# Altium schematic sheet 01-PCIe.SchDoc
size A3; Customer: 01910; SheetNumber: 1; SheetTotal: 12
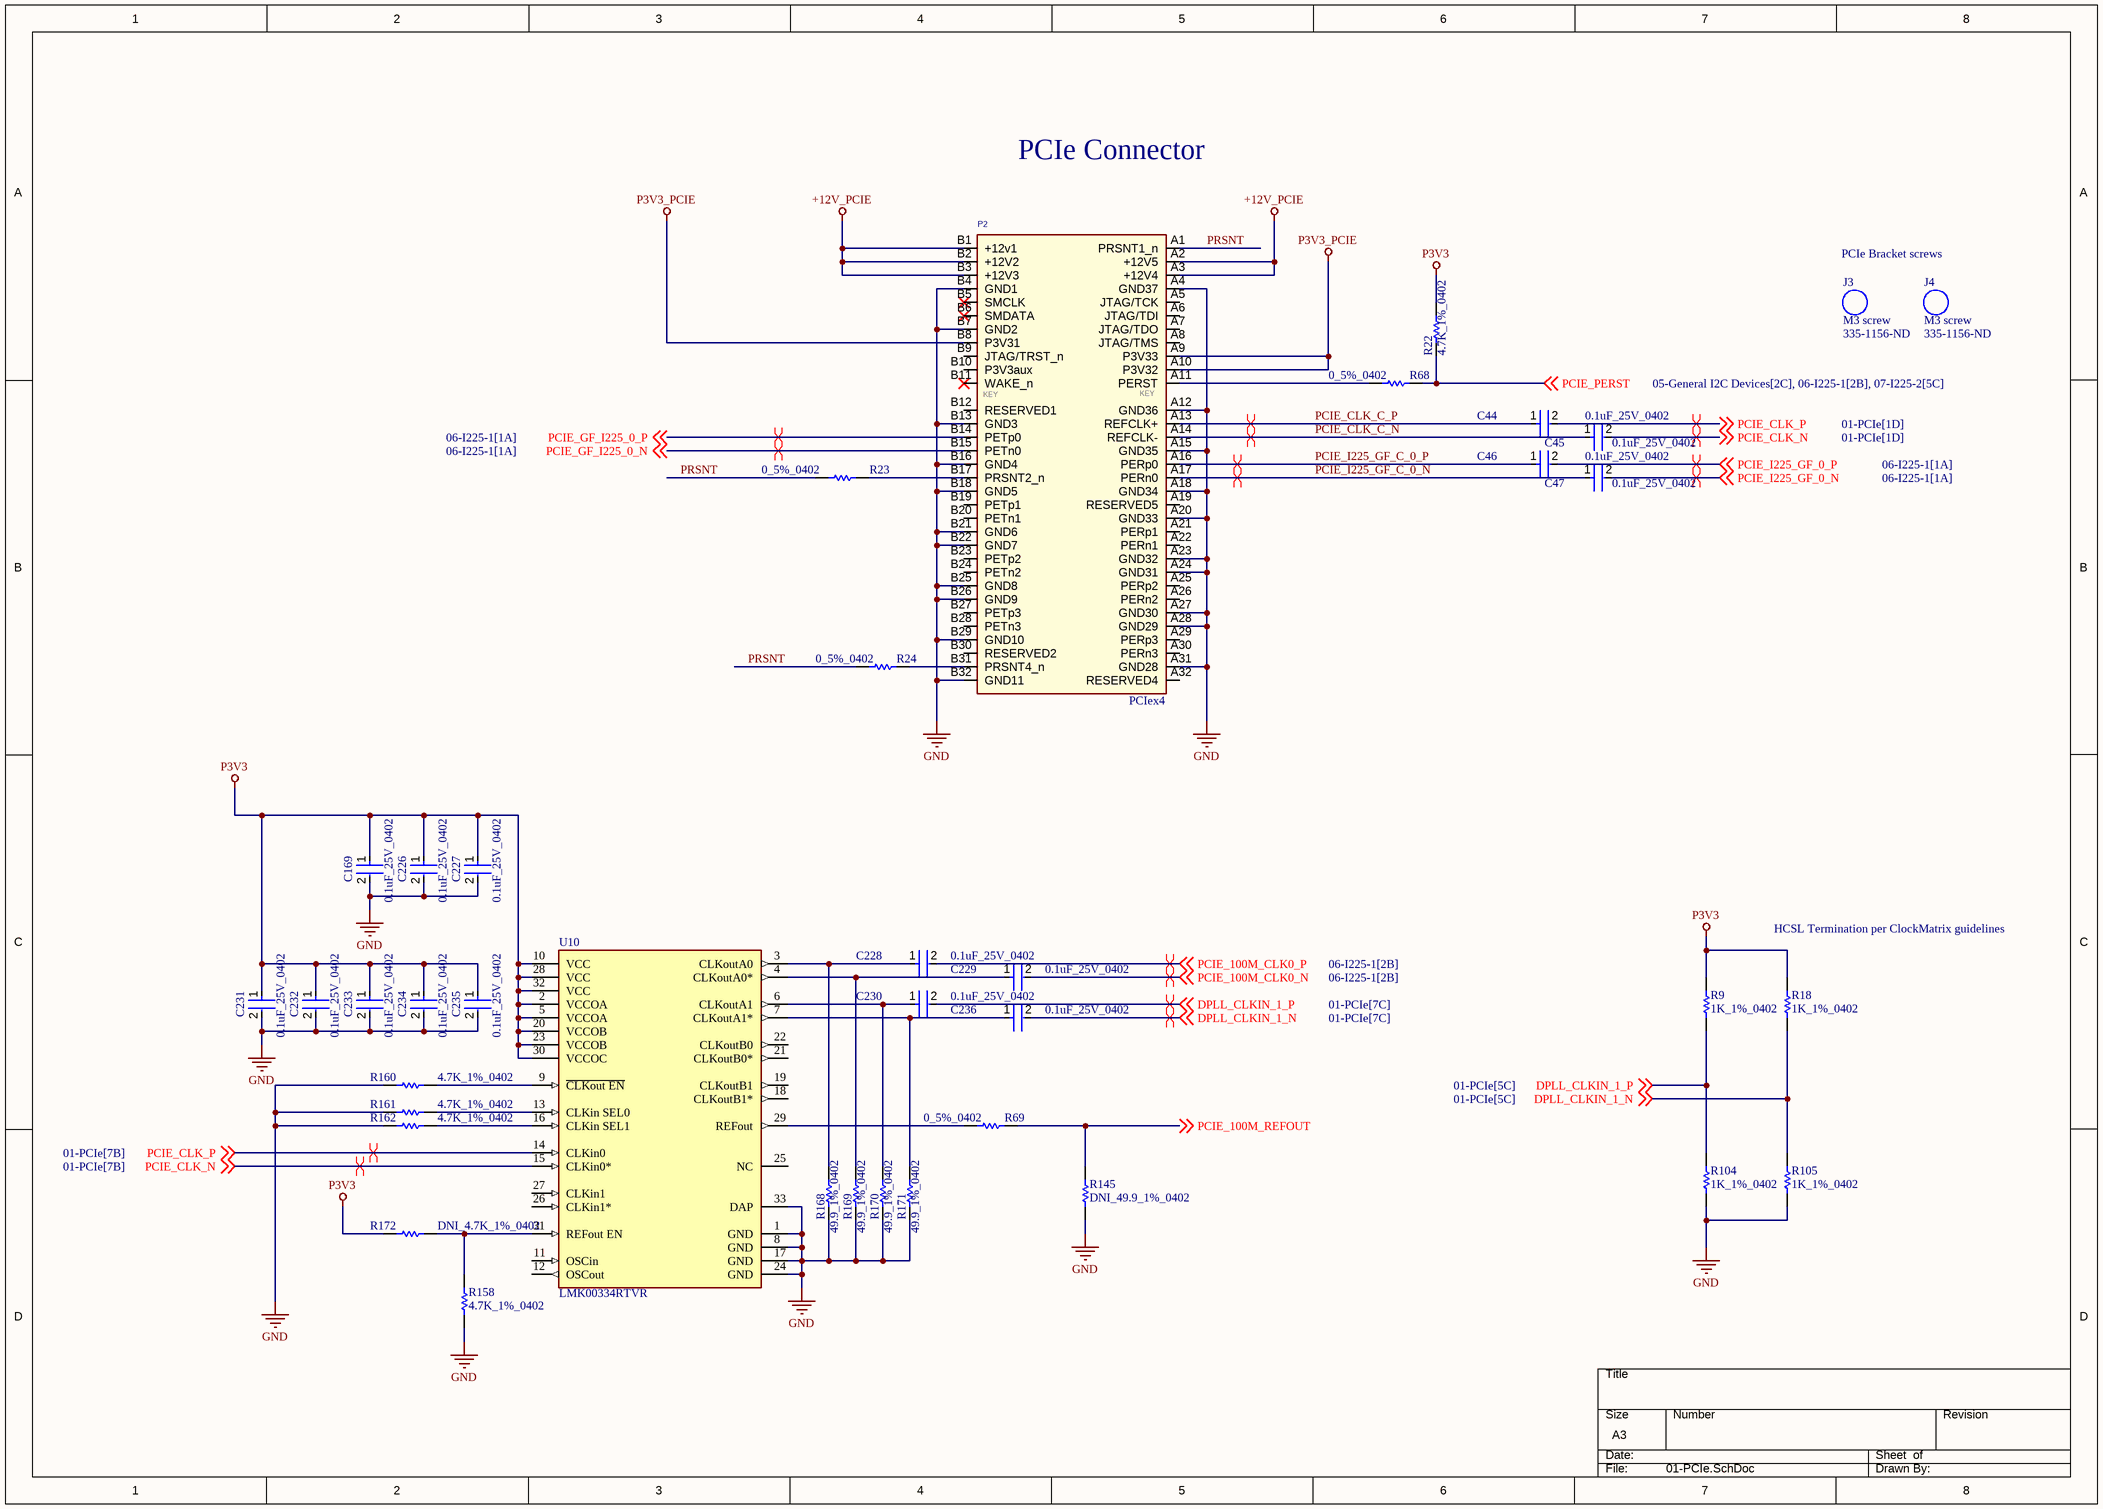
[diagram p0: 01-PCIe.SchDoc]

## Parts
C44  0.1uF_25V_0402  [FP-0402-L_1_0_1-W_0_5_0_1-IPC_C]
C45  0.1uF_25V_0402  [FP-0402-L_1_0_1-W_0_5_0_1-IPC_C]
C46  0.1uF_25V_0402  [FP-0402-L_1_0_1-W_0_5_0_1-IPC_C]
C47  0.1uF_25V_0402  [FP-0402-L_1_0_1-W_0_5_0_1-IPC_C]
C169  0.1uF_25V_0402  [FP-0402-L_1_0_1-W_0_5_0_1-IPC_C]
C226  0.1uF_25V_0402  [FP-0402-L_1_0_1-W_0_5_0_1-IPC_C]
C227  0.1uF_25V_0402  [FP-0402-L_1_0_1-W_0_5_0_1-IPC_C]
C228  0.1uF_25V_0402  [FP-0402-L_1_0_1-W_0_5_0_1-IPC_C]
C229  0.1uF_25V_0402  [FP-0402-L_1_0_1-W_0_5_0_1-IPC_C]
C230  0.1uF_25V_0402  [FP-0402-L_1_0_1-W_0_5_0_1-IPC_C]
C231  0.1uF_25V_0402  [FP-0402-L_1_0_1-W_0_5_0_1-IPC_C]
C232  0.1uF_25V_0402  [FP-0402-L_1_0_1-W_0_5_0_1-IPC_C]
C233  0.1uF_25V_0402  [FP-0402-L_1_0_1-W_0_5_0_1-IPC_C]
C234  0.1uF_25V_0402  [FP-0402-L_1_0_1-W_0_5_0_1-IPC_C]
C235  0.1uF_25V_0402  [FP-0402-L_1_0_1-W_0_5_0_1-IPC_C]
C236  0.1uF_25V_0402  [FP-0402-L_1_0_1-W_0_5_0_1-IPC_C]
J3  M3 screw  Supplier Part Number 1: 335-1156-ND  (no BOM)
J4  M3 screw  Supplier Part Number 1: 335-1156-ND  (no BOM)
P2  PCIex4  [PCIE_4LANE_EDGE]  (no BOM)
R9  1K_1%_0402  [RESC1005X40X25NL05T05]
R18  1K_1%_0402  [RESC1005X40X25NL05T05]
R22  4.7K_1%_0402  [RESC1005X40X25NL10T10]
R23  0_5%_0402  [RESC1005X40X25LL10T10]
R24  0_5%_0402  [RESC1005X40X25LL10T10]
R68  0_5%_0402  [RESC1005X40X25LL10T10]
R69  0_5%_0402  [RESC1005X40X25LL10T10]
R104  1K_1%_0402  [RESC1005X40X25NL05T05]
R105  1K_1%_0402  [RESC1005X40X25NL05T05]
R145  DNI_49.9_1%_0402  [RESC1005X40X25NL10T10]  (no BOM)
R158  4.7K_1%_0402  [RESC1005X40X25NL10T10]
R160  4.7K_1%_0402  [RESC1005X40X25NL10T10]
R161  4.7K_1%_0402  [RESC1005X40X25NL10T10]
R162  4.7K_1%_0402  [RESC1005X40X25NL10T10]
R168  49.9_1%_0402  [RESC1005X40X25NL10T10]
R169  49.9_1%_0402  [RESC1005X40X25NL10T10]
R170  49.9_1%_0402  [RESC1005X40X25NL10T10]
R171  49.9_1%_0402  [RESC1005X40X25NL10T10]
R172  DNI_4.7K_1%_0402  [RESC1005X40X25NL10T10]  (no BOM)
U10  LMK00334RTVR  [FP-RTV0032A-MFG]

## Nets
+12V_PCIE: P2.A2(+12V5) P2.A3(+12V4) P2.B1(+12v1) P2.B2(+12V2) P2.B3(+12V3)
GND: C169.2 C226.2 C227.2 C231.2 C232.2 C233.2 C234.2 C235.2 P2.A4(GND37) P2.A12(GND36) P2.A15(GND35) P2.A18(GND34) P2.A20(GND33) P2.A23(GND32) P2.A24(GND31) P2.A27(GND30) P2.A28(GND29) P2.A31(GND28) P2.B4(GND1) P2.B7(GND2) P2.B13(GND3) P2.B16(GND4) P2.B18(GND5) P2.B21(GND6) P2.B22(GND7) P2.B25(GND8) P2.B26(GND9) P2.B29(GND10) P2.B32(GND11) R104.1 R105.1 R145.2 R158.2 R160.2 R161.2 R162.2 R168.1 R169.1 R170.1 R171.1 U10.1(GND) U10.8(GND) U10.17(GND) U10.24(GND) U10.33(DAP)
P3V3: C169.1 C226.1 C227.1 C231.1 C232.1 C233.1 C234.1 C235.1 R9.2 R18.2 R22.2 R172.2 U10.2(VCCOA) U10.5(VCCOA) U10.10(VCC) U10.20(VCCOB) U10.23(VCCOB) U10.28(VCC) U10.30(VCCOC) U10.32(VCC)
P3V3_PCIE: P2.A9(P3V33) P2.A10(P3V32) P2.B8(P3V31)
DPLL_CLKIN_1_N: C236.2 R18.1 R105.2 ; off-sheet DPLL_CLKIN_1_N
DPLL_CLKIN_1_P: C230.2 R9.1 R104.2 ; off-sheet DPLL_CLKIN_1_P
PCIE_100M_CLK0_N: C229.2 ; off-sheet PCIE_100M_CLK0_N
PCIE_100M_CLK0_P: C228.2 ; off-sheet PCIE_100M_CLK0_P
PCIE_100M_REFOUT: R69.2 R145.1 ; off-sheet PCIE_100M_REFOUT
PCIE_CLK_C_N: C45.1 P2.A14(REFCLK-)
PCIE_CLK_C_P: C44.1 P2.A13(REFCLK+)
PCIE_CLK_N: C45.2 U10.15(CLKin0*) ; off-sheet PCIE_CLK_N
PCIE_CLK_P: C44.2 U10.14(CLKin0) ; off-sheet PCIE_CLK_P
PCIE_GF_I225_0_N: P2.B15(PETn0) ; off-sheet PCIE_GF_I225_0_N
PCIE_GF_I225_0_P: P2.B14(PETp0) ; off-sheet PCIE_GF_I225_0_P
PCIE_I225_GF_0_N: C47.2 ; off-sheet PCIE_I225_GF_0_N
PCIE_I225_GF_0_P: C46.2 ; off-sheet PCIE_I225_GF_0_P
PCIE_I225_GF_C_0_N: C47.1 P2.A17(PERn0)
PCIE_I225_GF_C_0_P: C46.1 P2.A16(PERp0)
PCIE_PERST: R22.1 R68.2 ; off-sheet PCIE_PERST
PRSNT: P2.A1(PRSNT1_n) R23.1 R24.1
NetC228_1: C228.1 R168.2 U10.3(CLKoutA0)
NetC229_1: C229.1 R169.2 U10.4(CLKoutA0*)
NetC230_1: C230.1 R170.2 U10.6(CLKoutA1)
NetC236_1: C236.1 R171.2 U10.7(CLKoutA1*)
NetP2_A11: P2.A11(PERST) R68.1
NetP2_B17: P2.B17(PRSNT2_n) R23.2
NetP2_B31: P2.B31(PRSNT4_n) R24.2
NetR69_1: R69.1 U10.29(REFout)
NetR158_1: R158.1 R172.1 U10.31(REFout_EN)
NetR160_1: R160.1 U10.9(~{CLKout_EN})
NetR161_1: R161.1 U10.13(CLKin_SEL0)
NetR162_1: R162.1 U10.16(CLKin_SEL1)

Not connected (* = marked no-connect by the designer): P2 A5(JTAG/TCK) A6(JTAG/TDI) A7(JTAG/TDO) A8(JTAG/TMS) A19(RESERVED5) A21(PERp1) A22(PERn1) A25(PERp2) A26(PERn2) A29(PERp3) A30(PERn3) A32(RESERVED4) B5(SMCLK)* B6(SMDATA)* B9(JTAG/TRST_n) B10(P3V3aux) B11(WAKE_n)* B12(RESERVED1) B19(PETp1) B20(PETn1) B23(PETp2) B24(PETn2) B27(PETp3) B28(PETn3) B30(RESERVED2); U10 11(OSCin) 12(OSCout) 18(CLKoutB1*) 19(CLKoutB1) 21(CLKoutB0*) 22(CLKoutB0) 25(NC) 26(CLKin1*) 27(CLKin1)

## Layout directives
differential pair: DPLL_CLKIN_1_N, DPLL_CLKIN_1_P, PCIE_100M_CLK0_N, PCIE_100M_CLK0_P, PCIE_CLK_C_N, PCIE_CLK_C_P, PCIE_CLK_N, PCIE_CLK_P, PCIE_GF_I225_0_N, PCIE_GF_I225_0_P, PCIE_I225_GF_0_N, PCIE_I225_GF_0_P, PCIE_I225_GF_C_0_N, PCIE_I225_GF_C_0_P

## Notes on the sheet
- PCIe Connector
- PCIe Bracket screws
- HCSL Termination per ClockMatrix guidelines
- SHEET
- REV
- timingcard.com <http://timingcard.com>
- DATE
- OF
- (in symbol PCIex4) KEY

## Library data of the parts
C44-C47 C169 C226-C236 = CMP-2008-02519-2: General Purpose Ceramic Capacitor, 0402, 100nF, 10%, X7R, 15%, 25V; Package Quantity: 1; Capacitance: 100nF; Min Operating Temperature: -55°C; Voltage: 25V; Voltage Rating: 25V; Construction: Flat; Max Operating Temperature: 125°C; Radiation Hardening: No; Depth: 0.5mm; Thickness: 0.022inch; Voltage Rating (DC): 25V; Number of Pins: 2; Lead Free: Lead Free; Series: -; REACH SVHC: No SVHC; Length: 1mm; Dielectric: X7R; RoHS Compliant: Yes; Mount: Surface Mount; Packaging: Tape and Reel; Case/Package: 0402; Case Code (Imperial): 0402; Termination: SMD/SMT; Width: 0.02inch; Case Code (Metric): 1005; Tolerance: 10%
P2 = PCIex4: PCIE x4 Edge Connector,OrCAD Symbol,NC; Part Number: 451; Manufacturer: NA; NOTE: NC; Vendor P/N: NA; Part Type: SMT
R9 R18 R104 R105 = CMP-2002-08277-1: Manufacturer: Vishay Dale; Part Number: CRCW04021K00FKTD
R22 R158 R160-R162 R172 = CMP-2002-05217-1: Manufacturer: Bourns; Part Number: CR0402-FX-4701GLF
R23 R24 R68 R69 = CMP-2002-04569-1: Manufacturer: KOA Speer; Part Number: RK73Z1ETTP
R145 R168-R171 = CMP-2002-04448-1: Part Number: RK73H1ETTP49R9F; Manufacturer: KOA Speer
U10 = CMP-04855-000011-1: IC CLK BUF 400MHZ 1CIRC 32WQFN; Number of Outputs: 4; Max Supply Voltage: 3.45V; PLL: No; Max Duty Cycle: 55%; Operating Supply Current: 13.5mA; Min Supply Voltage: 3.15V; Nominal Supply Current: 8.5mA; Input: Crystal; Propagation Delay: 2700ps; Operating Supply Voltage: 3.3V; Number of Circuits: 1; REACH SVHC: No SVHC; Radiation Hardening: No; RoHS Compliant: Yes; Lead Free: Lead Free; Mount: Surface Mount; Min Operating Temperature: -40°C; Package Quantity: 1000; Max Operating Temperature: 85°C; Number of Pins: 32; Max Frequency: 400MHz; Frequency: 400MHz; Packaging: Tape and Reel
J3 J4 = M3 screw: Supplier 1: Digi-Key